# EAGLE design chip_crumb (EAGLE 6.5.0)
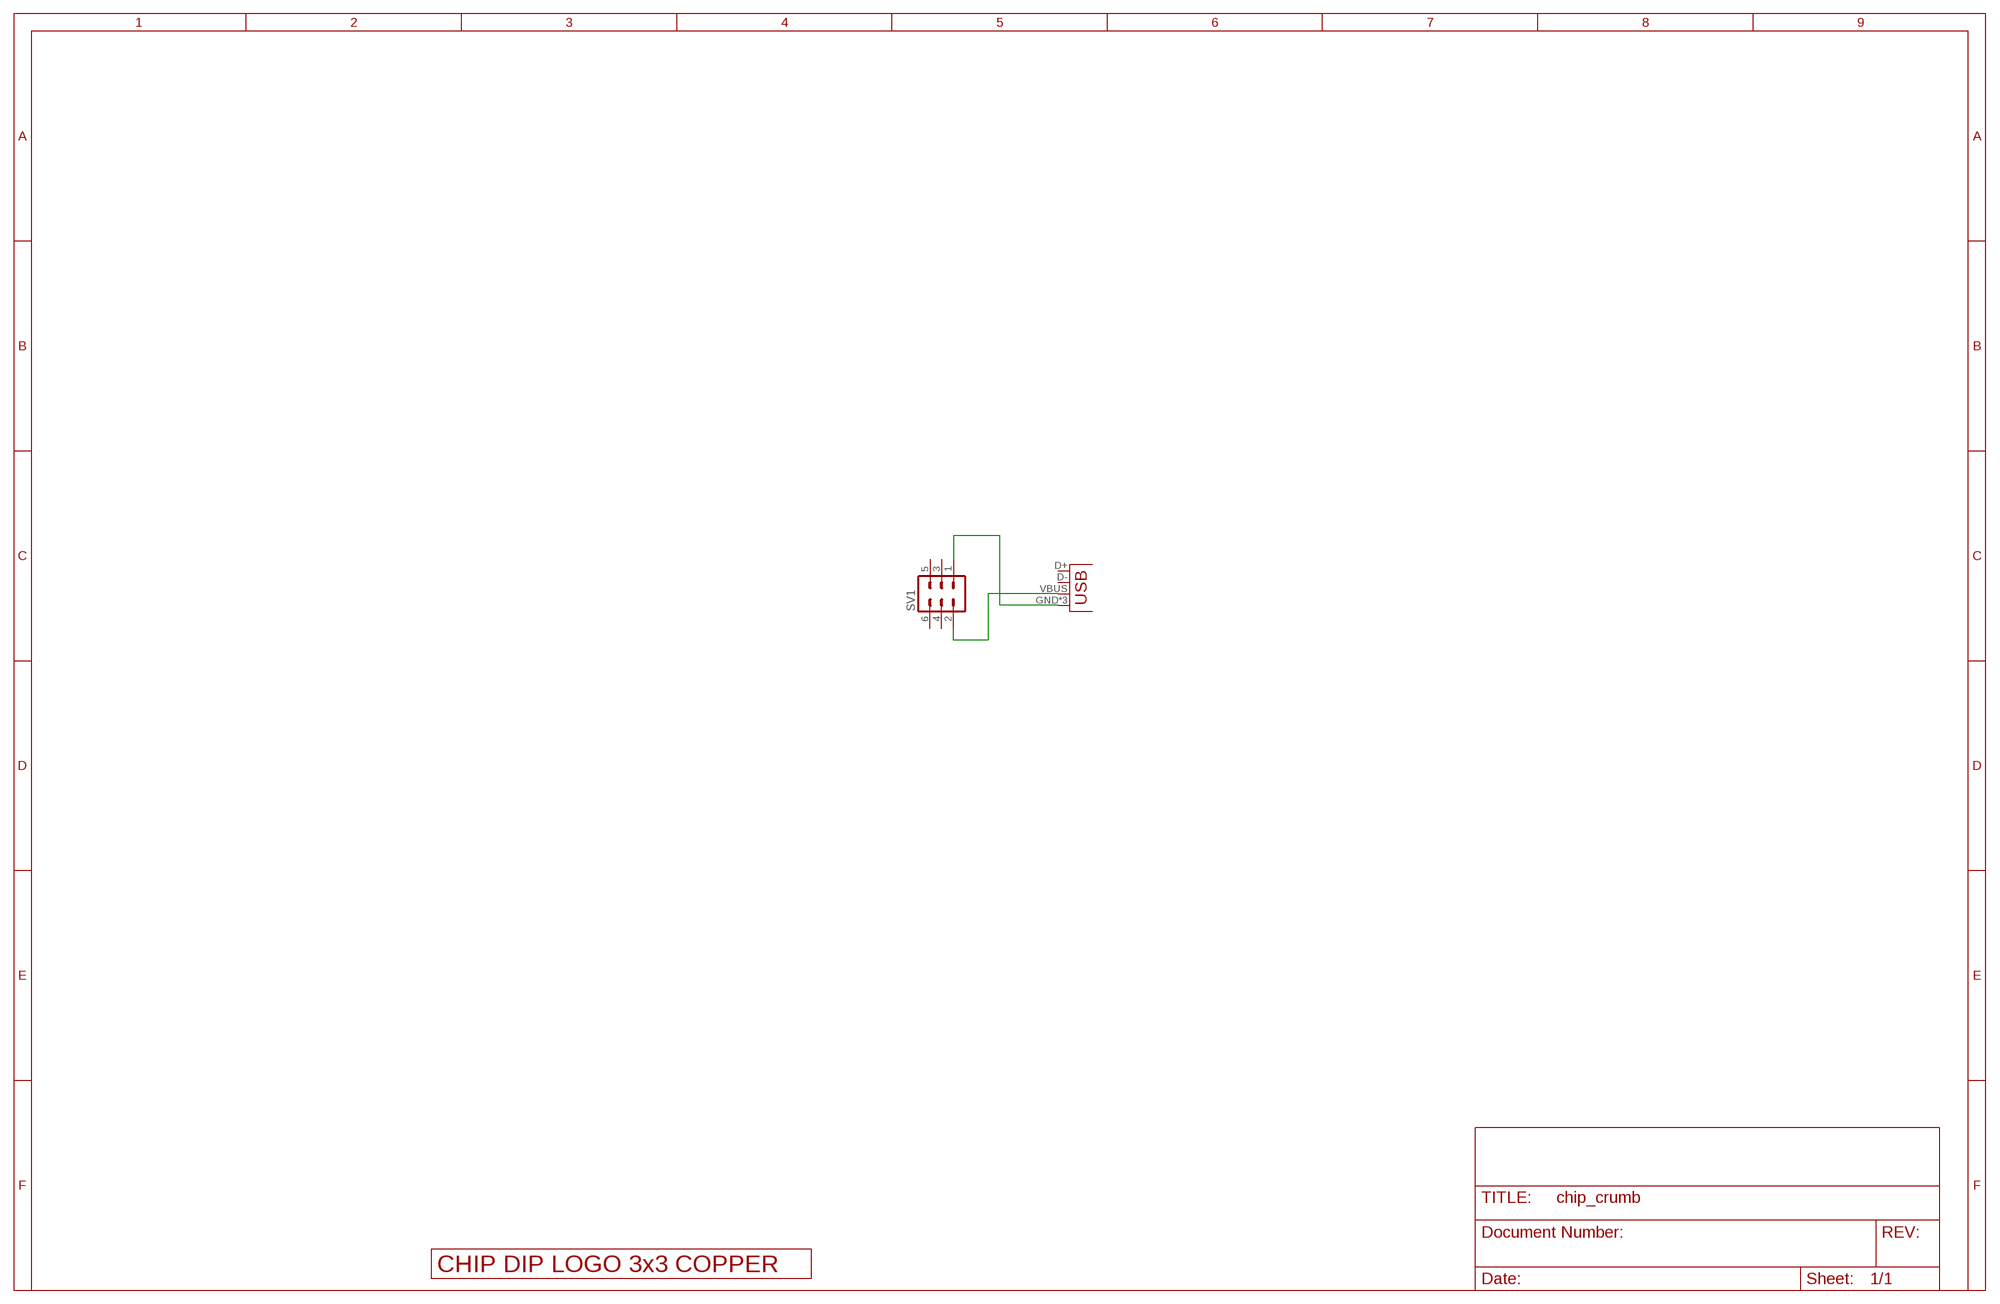
[diagram p0: schematic, sheet 1]

## Parts
SV1  MA03-2  [MA03-2]
U$4  LOGO_3X3_COPPER  [LOGO_3X3_COPPER]
USB  USBUSB-MICROB-SMT-DIP  [USB-MICROB-SMT-DIP]

## Nets
GND: SV1.1 USB.GND USB.MT1(GND) USB.MT2(GND)
N$2: SV1.2 USB.VBUS
Unconnected: SV1.3 SV1.4 SV1.5 SV1.6 USB.D+ USB.D-

## Library data of the parts
SV1 = con-lstb:MA03-2: PIN HEADER; OC_FARNELL: unknown; OC_NEWARK: unknown
U$4 = logo:LOGO_3X3_COPPER
USB = Spark:USB

## Board
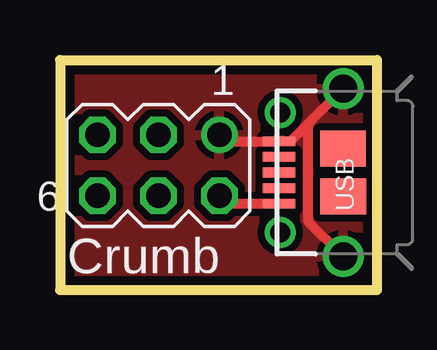
[diagram p1: board, top side]
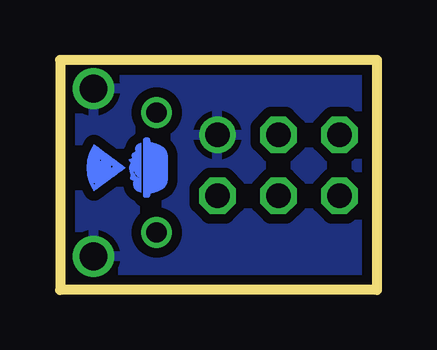
[diagram p2: board, bottom side, seen from below]

Size 13.2 x 9.6 mm. Coordinates in mm from the lower left corner, seen from the top.
Outline: 0,9.6 13.2,9.6 13.2,0 0,0 0,9.6
Copper layers (1*16): Top 0.0356mm / dielectric 1.5011mm / Bottom 0.0356mm
Design rules "LaenPCBOrder": minimum track width 6mil, minimum drill 13mil, track to track 6mil, track to pad 6mil, pad to pad 6mil, via to via 6mil, smd to smd 6mil, copper to edge 15mil, drill to drill 6mil, minimum pad ring 7mil, minimum via ring 7mil, stop-mask expansion 3mil, vias tented up to drill 0mil, thermal gap 10mil

### Footprints (pad centres in the part's own frame; a part is rotated, then mirrored left to right if it is on the bottom)
MA03-2 = drill 1.016: 1 -2.54,-1.27 | drill 1.016 octagon: 2 -2.54,1.27; 3 0,-1.27; 4 0,1.27; 5 2.54,-1.27; 6 2.54,1.27
USB-MICROB-SMT-DIP = smd 0.4 x 1.35: D+ 0,2.675; D- -0.65,2.675; GND 1.3,2.675; ID 0.65,2.675; VBUS -1.3,2.675 | drill 1.15 pad 1.7: MT1 -3.5,0; MT2 3.5,0 | drill 0.85 pad 1.25: MT3 -2.5,2.625; MT4 2.5,2.625 | smd 1.5 x 1.9: P$1 -1,0; P$2 1,0.01

### Placement (x,y rotation side)
SV1  4.1,5.2 180 top
U$4  10.4,5.1 90 bottom
USB  11.8,4.9 90 top

### Tracks (layer width: path | path; a pad name or v marks a point on that pad's centre or on a via)
GND
  Top 0.406: SV1.1 6.91,6.2 USB.GND 9.6,6.2 10.35,6.95 | USB.MT2 10.35,6.95 | USB.MT1 10.35,2.85 10.35,6.95
  pour Top (isolate 0.305, rank 2): 0,0.24 13.2,0.24 13.2,9.6 0,9.6
  pour Bottom (isolate 0.406): 0,9.6 13.2,9.6 13.2,0.24 0.02,0.24
N$2
  Top 0.406: USB.VBUS 6.97,3.6 SV1.2

### Text on the board
Unrouted: not ordered
tPlace: Crumb